# Altium schematic sheet ADE_Sche.SchDoc
size A
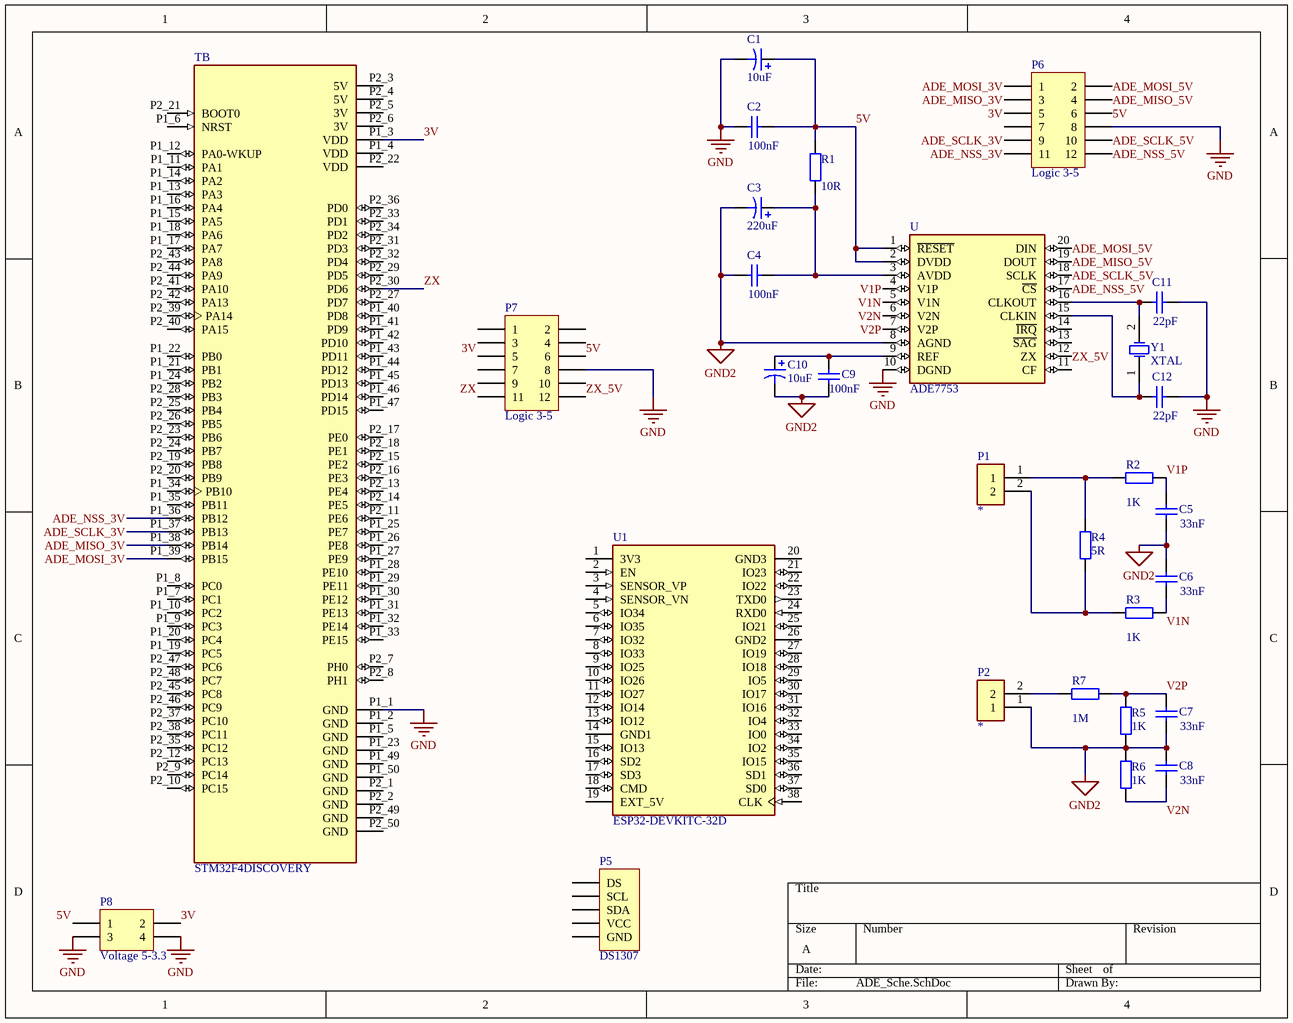
[diagram p0: ADE_Sche.SchDoc]

## Parts
C1  value 10uF  [Tu hóa 10uF 50v]  (hidden comment: Cap Pol1)
C2  value 100nF  [RAD-0.3]  (hidden comment: Cap)
C3  value 220uF  [Tu hóa 220uF 10 or 16V]  (hidden comment: Cap Pol1)
C4  value 100nF  [RAD-0.3]  (hidden comment: Cap)
C5  value 33nF  [RAD-0.3]  (hidden comment: Cap)
C6  value 33nF  [RAD-0.3]  (hidden comment: Cap)
C7  value 33nF  [RAD-0.3]  (hidden comment: Cap)
C8  value 33nF  [RAD-0.3]  (hidden comment: Cap)
C9  value 100nF  [RAD-0.3]  (hidden comment: Cap)
C10  value 10uF  [Tu hóa 10uF 50v]  (hidden comment: Cap Pol1)
C11  value 22pF  [RAD-0.3]  (hidden comment: Cap)
C12  value 22pF  [RAD-0.3]  (hidden comment: Cap)
P1  282837-2  [TE_282837-2]  (value not drawn)
P2  282837-2  [TE_282837-2]  (value not drawn)
P5  DS1307  [DS1307]
P6  Logic 3-5  [Logic level 3-5]
P7  Logic 3-5  [Logic level 3-5]
P8  Voltage 5-3.3  [AMS1117 Circuit]
R1  value 10R  [AXIAL-0.4]  (hidden comment: Res2)
R2  value 1K  [AXIAL-0.4]  (hidden comment: Res2)
R3  value 1K  [AXIAL-0.4]  (hidden comment: Res2)
R4  value 5R  [AXIAL-0.4]  (hidden comment: Res2)
R5  value 1K  [AXIAL-0.4]  (hidden comment: Res2)
R6  value 1K  [AXIAL-0.4]  (hidden comment: Res2)
R7  value 1M  [AXIAL-0.4]  (hidden comment: Res2)
TB  STM32F4DISCOVERY  [MODULE_STM32F4DISCOVERY]
U  ADE7753  [ADE7753_alter]
U1  ESP32-DEVKITC-32D  [MODULE_ESP32-DEVKITC-32D]
Y1  XTAL  [3.5795 mhz crystal]

## Nets
GND: C1.2 C2.1 C11.1 C12.1 P6.8 P7.8 P8.3 P8.4 TB.P1_1(GND) U.10(DGND)
GND2: C3.2 C4.1 C5.2 C6.1 C7.2 C8.2 C9.1 C10.2 P2.1 R5.2 R6.2 U.8(AGND)
3V: P6.5 P7.5 P8.2 TB.P1_3(VDD)
5V: C1.1 C2.2 P6.6 P7.6 P8.1 R1.2 U.1(~{RESET}) U.2(DVDD)
ADE_MISO_3V: P6.3 TB.P1_38(PB14)
ADE_MISO_5V: P6.4 U.19(DOUT)
ADE_MOSI_3V: P6.1 TB.P1_39(PB15)
ADE_MOSI_5V: P6.2 U.20(DIN)
ADE_NSS_3V: P6.11 TB.P1_36(PB12)
ADE_NSS_5V: P6.12 U.17(~{CS})
ADE_SCLK_3V: P6.9 TB.P1_37(PB13)
ADE_SCLK_5V: P6.10 U.18(SCLK)
V1N: C6.2 R3.2 U.5(V1N)
V1P: C5.1 R2.2 U.4(V1P)
V2N: C8.1 R6.1 U.6(V2N)
V2P: C7.1 R5.1 R7.2 U.7(V2P)
ZX: P7.11 TB.P2_30(PD6)
ZX_5V: P7.12 U.12(ZX)
NetC3_1: C3.1 C4.2 R1.1 U.3(AVDD)
NetC9_2: C9.2 C10.1 U.9(REF)
NetC11_2: C11.2 U.16(CLKOUT) Y1.2(OSC2)
NetC12_2: C12.2 U.15(CLKIN) Y1.1(OSC1)
NetP1_1: P1.1 R2.1 R4.2
NetP1_2: P1.2 R3.1 R4.1
NetP2_2: P2.2 R7.1

Not connected (* = marked no-connect by the designer): P5 1(DS) 2(SCL) 3(SDA) 4(VCC) 5(GND); P6 7; P7 1 2 3 4 7 9 10; TB P1_2(GND) P1_4(VDD) P1_5(GND) P1_6(NRST) P1_7(PC1) P1_8(PC0) P1_9(PC3) P1_10(PC2) P1_11(PA1) P1_12(PA0-WKUP) P1_13(PA3) P1_14(PA2) P1_15(PA5) P1_16(PA4) P1_17(PA7) P1_18(PA6) P1_19(PC5) P1_20(PC4) P1_21(PB1) P1_22(PB0) P1_23(GND) P1_24(PB2) P1_25(PE7) P1_26(PE8) P1_27(PE9) P1_28(PE10) P1_29(PE11) P1_30(PE12) P1_31(PE13) P1_32(PE14) P1_33(PE15) P1_34(PB10) P1_35(PB11) P1_40(PD8) P1_41(PD9) P1_42(PD10) P1_43(PD11) P1_44(PD12) P1_45(PD13) P1_46(PD14) P1_47(PD15) P1_49(GND) P1_50(GND) P2_1(GND) P2_2(GND) P2_3(5V) P2_4(5V) P2_5(3V) P2_6(3V) P2_7(PH0) P2_8(PH1) P2_9(PC14) P2_10(PC15) P2_11(PE6) P2_12(PC13) P2_13(PE4) P2_14(PE5) P2_15(PE2) P2_16(PE3) P2_17(PE0) P2_18(PE1) P2_19(PB8) P2_20(PB9) P2_21(BOOT0) P2_22(VDD) P2_23(PB6) P2_24(PB7) P2_25(PB4) P2_26(PB5) P2_27(PD7) P2_28(PB3) P2_29(PD5) P2_31(PD3) P2_32(PD4) P2_33(PD1) P2_34(PD2) P2_35(PC12) P2_36(PD0) P2_37(PC10) P2_38(PC11) P2_39(PA14) P2_40(PA15) P2_41(PA10) P2_42(PA13) P2_43(PA8) P2_44(PA9) P2_45(PC8) P2_46(PC9) P2_47(PC6) P2_48(PC7) P2_49(GND) P2_50(GND); U 11(CF) 13(~{SAG}) 14(~{IRQ}); U1 1(3V3) 2(EN) 3(SENSOR_VP) 4(SENSOR_VN) 5(IO34) 6(IO35) 7(IO32) 8(IO33) 9(IO25) 10(IO26) 11(IO27) 12(IO14) 13(IO12) 14(GND1) 15(IO13) 16(SD2) 17(SD3) 18(CMD) 19(EXT_5V) 20(GND3) 21(IO23) 22(IO22) 23(TXD0) 24(RXD0) 25(IO21) 26(GND2) 27(IO19) 28(IO18) 29(IO5) 30(IO17) 31(IO16) 32(IO4) 33(IO0) 34(IO2) 35(IO15) 36(SD1) 37(SD0) 38(CLK)

## Library data of the parts
C1 C3 C10 = Cap Pol1: Polarized Capacitor (Radial); Published: 8-Jun-2000; LatestRevisionDate: 17-Jul-2002; LatestRevisionNote: Re-released for DXP Platform.; PackageReference: RB7.6-15; Publisher: Altium Limited; PackageDescription: Polarized Capacitor (Radial); 2 Leads
C2 C4-C9 C11 C12 = Cap: Capacitor; Published: 8-Jun-2000; LatestRevisionDate: 17-Jul-2002; LatestRevisionNote: Re-released for DXP Platform.; PackageReference: RAD-0.3; Publisher: Altium Limited; PackageDescription: Radial Cap, Thru-Hole; 2 Leads; 0.3 in Pin Spacing
P1 P2 = 282837-2: Connector Terminal Blocks Receptacle 2 Position 5.08mm Solder Straight Thru-Hole 13.5A/Contact; MF: TE Connectivity; Digi-Key_Purchase_URL: https://www.digikey.in/product-detail/en/te-connectivity-amp-connectors/282837-2/A113320-ND/2187973?utm_source=snapeda&utm_medium=aggregator&utm_campaign=symbol; Value: *; TE_purchase_URL: https://www.te.com/usa-en/product-282837-2.html?te_bu=Cor&te_type=disp&te_campaign=seda_glo_cor-seda-global-disp-prtnr-fy19-seda-model-bom-cta_sma-317_1&elqCampaignId=32493; Package: None; MP: 282837-2; SnapEDA_Link: https://www.snapeda.com/parts/282837-2/TE%20Connectivity%20AMP%20Connectors/view-part/2549980/?ref=snap; Digi-Key_Part_Number: A113320-ND; Comment_1: *
P5 = Header 5: Header, 5-Pin; LatestRevisionDate: 17-Jul-2002; LatestRevisionNote: Re-released for DXP Platform.; Publisher: Altium Limited
P6 P7 = Header 6X2: Header, 6-Pin, Dual row; LatestRevisionDate: 17-Jul-2002; LatestRevisionNote: Re-released for DXP Platform.; Publisher: Altium Limited
P8 = Header 2X2: Header, 2-Pin, Dual row; LatestRevisionDate: 17-Jul-2002; LatestRevisionNote: Re-released for DXP Platform.; Publisher: Altium Limited
R1-R7 = Res2: Resistor; Published: 8-Jun-2000; LatestRevisionDate: 17-Jul-2002; LatestRevisionNote: Re-released for DXP Platform.; PackageReference: AXIAL-0.4; Publisher: Altium Limited; PackageDescription: Axial Device, Thru-Hole; 2 Leads; 0.4 in Pin Spacing
TB = STM32F4DISCOVERY: STM32F407VGT6 Discovery STM32F4 ARMÂ® CortexÂ®-M4 MCU 32-Bit Embedded Evaluation Board; MF: STMicroelectronics; MP: STM32F4DISCOVERY; Package: None; Price: None; Availability: Unavailable; Value: *; SnapEDA_Link: https://www.snapeda.com/parts/STM32F4DISCOVERY/STMicroelectronics/view-part/46335/?ref=snap
U = ADE7753: IC ENERGY METERING 1PHASE 20SSOP; MF: Analog Devices; Digi-Key_Part_Number: ADE7753ARSZRLCT-ND; SnapEDA_Link: https://www.snapeda.com/parts/ADE7753/Analog%20Devices%20Inc./view-part/3209960/?ref=snap; Package: SSOP-20 Analog Devices; Value: *; MP: ADE7753
U1 = ESP32-DEVKITC-32D: - Transceiver; 802.11 b/g/n _Wi-Fi, WiFi, WLAN_, BluetoothÂ® Smart Ready 4.x Dual Mode For Use With ESP-WROOM-32; MF: Espressif Systems; Package: None; Price: None; Availability: Unavailable; MP: ESP32-DEVKITC-32D; SnapEDA_Link: https://www.snapeda.com/parts/ESP32-DEVKITC-32D/Espressif%20Systems/view-part/2777395/?ref=snap; Value: *
Y1 = XTAL: Crystal Oscillator; Published: 8-Jun-2000; LatestRevisionDate: 17-Jul-2002; LatestRevisionNote: Re-released for DXP Platform.; PackageReference: R38; Publisher: Altium Limited; PackageDescription: Crystal, Thru-Hole; 2 Leads; Body 3.1 x 8.2 mm (Dia.xH)